# Altium schematic sheet UTHP Buffer Circuits.SchDoc: Ultimate Truck Hacking Platform
size Letter; Author: Dr. Jeremy Daily; Organization: Systems Cyber Research Group; Address2: Thomas Balzer; Address3: Carson Green; DocumentNumber: Circuit Protections; Revision: 1; SheetNumber: 5; SheetTotal: 6
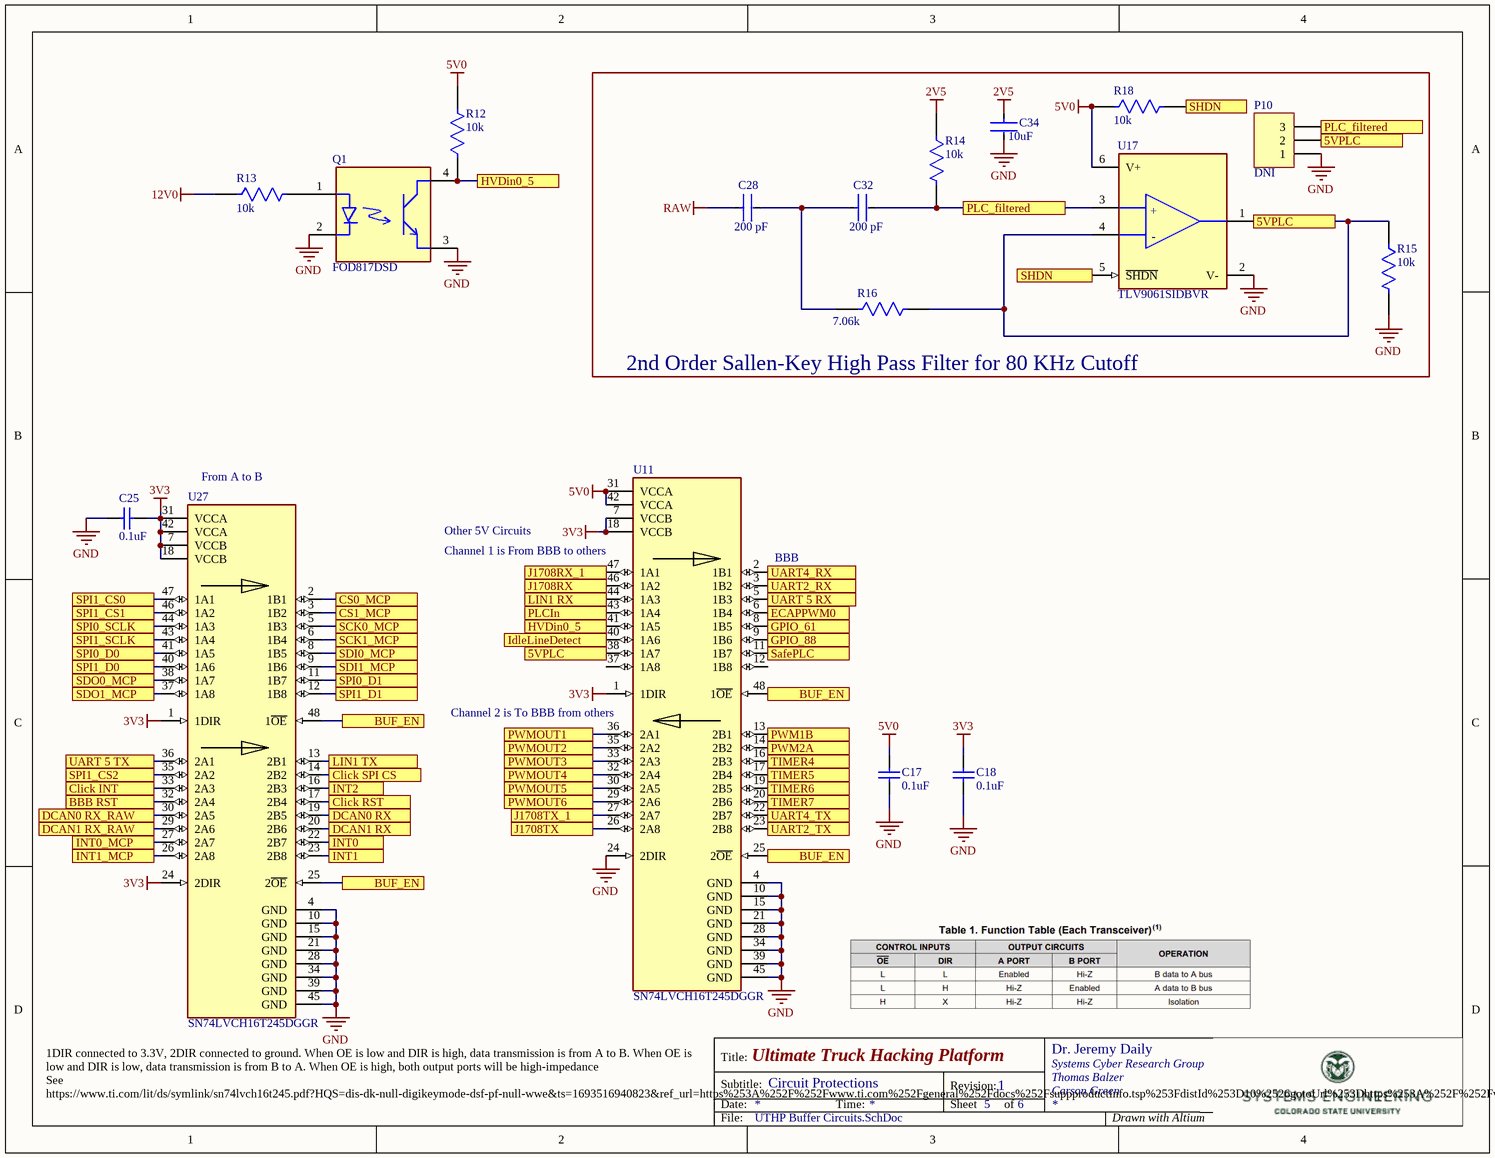
[diagram p0: UTHP Buffer Circuits.SchDoc]

## Parts
C17  0.1uF  [CAPC1608X90X35LL15T15]
C18  0.1uF  [CAPC1608X90X35LL15T15]
C25  0.1uF  [CAPC1608X90X35LL15T15]
C28  value 200 pF  [FP-C0603C-CF-MFG]  (hidden comment: C0603C201J5GACTU)
C32  value 200 pF  [FP-C0603C-CF-MFG]  (hidden comment: C0603C201J5GACTU)
C34  10uF  [FP-MK325A-MFG]
P10  DNI  [HDR1X3]
Q1  FOD817DSD  [FP-709AH-MFG]
R12  10k  [FP-KTR03-IPC_B]
R13  10k  [FP-KTR03-IPC_B]
R14  10k  [FP-KTR03-IPC_B]
R15  10k  [FP-KTR03-IPC_B]
R16  Resistance: 7.06k  [FP-RN731J-IPC_C]  (hidden comment: RN731JTTD7061F25)
R18  10k  [FP-KTR03-IPC_B]
U11  SN74LVCH16T245DGGR  [FP-DGG0048A-MFG]
U17  TLV9061SIDBVR  [FP-DBV0006A-MFG]
U27  SN74LVCH16T245DGGR  [FP-DGG0048A-MFG]

## Blocks framed on the sheet
2nd Order Sallen-Key High Pass Filter for 80 KHz Cutoff: C28 C32 C34 P10 R14-R16 R18 U17

## Ports
5VPLC, BBB RST, BUF_EN, Click INT, Click RST, Click SPI CS, CS0_MCP, CS1_MCP, DCAN0 RX, DCAN0 RX_RAW, DCAN1 RX, DCAN1 RX_RAW, ECAPPWM0, GPIO_61, GPIO_88, HVDin0_5, IdleLineDetect, INT0, INT0_MCP, INT1, INT1_MCP, INT2, J1708RX, J1708RX_1, J1708TX, J1708TX_1, LIN1 RX, LIN1 TX, PLC_filtered, PLCIn, PWM1B, PWM2A, PWMOUT1, PWMOUT2, PWMOUT3, PWMOUT4, PWMOUT5, PWMOUT6, SafePLC, SCK0_MCP, SCK1_MCP, SDI0_MCP, SDI1_MCP, SDO0_MCP, SDO1_MCP, SHDN, SPI0_D0, SPI0_D1, SPI0_SCLK, SPI1_CS0, SPI1_CS1, SPI1_CS2, SPI1_D0, SPI1_D1, SPI1_SCLK, TIMER4, TIMER5, TIMER6, TIMER7, UART2_RX, UART2_TX, UART4_RX, UART4_TX, UART 5 RX, UART 5 TX

## Nets
2V5: C34.1 R14.1
3V3: C18.1 C25.1 U11.1(1DIR) U11.7(VCCB) U11.18(VCCB) U27.1(1DIR) U27.7(VCCB) U27.18(VCCB) U27.24(2DIR) U27.31(VCCA) U27.42(VCCA)
5V0: C17.1 R12.2 R18.1 U11.31(VCCA) U11.42(VCCA) U17.6(V+)
12V0: R13.1
GND: C17.2 C18.2 C25.2 C34.2 P10.1 Q1.2(C) Q1.3(E) R15.2 U11.4(GND) U11.10(GND) U11.15(GND) U11.21(GND) U11.24(2DIR) U11.28(GND) U11.34(GND) U11.39(GND) U11.45(GND) U17.2(V-) U27.4(GND) U27.10(GND) U27.15(GND) U27.21(GND) U27.28(GND) U27.34(GND) U27.39(GND) U27.45(GND)
RAW: C28.1
5VPLC: P10.2 R15.1 R16.2 U11.38(1A7) U17.1(OUT) U17.4(-IN) ; port 5VPLC
BBB RST: U27.32(2A4) ; port BBB RST
BUF_EN: U11.25(2~{OE}) U11.48(1~{OE}) U27.25(2~{OE}) U27.48(1~{OE}) ; port BUF_EN
Click INT: U27.33(2A3) ; port Click INT
Click RST: U27.17(2B4) ; port Click RST
Click SPI CS: U27.14(2B2) ; port Click SPI CS
CS0_MCP: U27.2(1B1) ; port CS0_MCP
CS1_MCP: U27.3(1B2) ; port CS1_MCP
DCAN0 RX: U27.19(2B5) ; port DCAN0 RX
DCAN0 RX_RAW: U27.30(2A5) ; port DCAN0 RX_RAW
DCAN1 RX: U27.20(2B6) ; port DCAN1 RX
DCAN1 RX_RAW: U27.29(2A6) ; port DCAN1 RX_RAW
ECAPPWM0: U11.6(1B4) ; port ECAPPWM0
GPIO_61: U11.8(1B5) ; port GPIO_61
GPIO_88: U11.9(1B6) ; port GPIO_88
HVDin0_5: Q1.4(C) R12.1 U11.41(1A5) ; port HVDin0_5
IdleLineDetect: U11.40(1A6) ; port IdleLineDetect
INT0: U27.22(2B7) ; port INT0
INT0_MCP: U27.27(2A7) ; port INT0_MCP
INT1: U27.23(2B8) ; port INT1
INT1_MCP: U27.26(2A8) ; port INT1_MCP
INT2: U27.16(2B3) ; port INT2
J1708RX: U11.46(1A2) ; port J1708RX
J1708RX_1: U11.47(1A1) ; port J1708RX_1
J1708TX: U11.26(2A8) ; port J1708TX
J1708TX_1: U11.27(2A7) ; port J1708TX_1
LIN1 RX: U11.44(1A3) ; port LIN1 RX
LIN1 TX: U27.13(2B1) ; port LIN1 TX
PLC_filtered: C32.2 P10.3 R14.2 U17.3(+IN) ; port PLC_filtered
PLCIn: U11.43(1A4) ; port PLCIn
PWM1B: U11.13(2B1) ; port PWM1B
PWM2A: U11.14(2B2) ; port PWM2A
PWMOUT1: U11.36(2A1) ; port PWMOUT1
PWMOUT2: U11.35(2A2) ; port PWMOUT2
PWMOUT3: U11.33(2A3) ; port PWMOUT3
PWMOUT4: U11.32(2A4) ; port PWMOUT4
PWMOUT5: U11.30(2A5) ; port PWMOUT5
PWMOUT6: U11.29(2A6) ; port PWMOUT6
SafePLC: U11.11(1B7) ; port SafePLC
SCK0_MCP: U27.5(1B3) ; port SCK0_MCP
SCK1_MCP: U27.6(1B4) ; port SCK1_MCP
SDI0_MCP: U27.8(1B5) ; port SDI0_MCP
SDI1_MCP: U27.9(1B6) ; port SDI1_MCP
SDO0_MCP: U27.38(1A7) ; port SDO0_MCP
SDO1_MCP: U27.37(1A8) ; port SDO1_MCP
SHDN: R18.2 U17.5(~{SHDN}) ; port SHDN
SPI0_D0: U27.41(1A5) ; port SPI0_D0
SPI0_D1: U27.11(1B7) ; port SPI0_D1
SPI0_SCLK: U27.44(1A3) ; port SPI0_SCLK
SPI1_CS0: U27.47(1A1) ; port SPI1_CS0
SPI1_CS1: U27.46(1A2) ; port SPI1_CS1
SPI1_CS2: U27.35(2A2) ; port SPI1_CS2
SPI1_D0: U27.40(1A6) ; port SPI1_D0
SPI1_D1: U27.12(1B8) ; port SPI1_D1
SPI1_SCLK: U27.43(1A4) ; port SPI1_SCLK
TIMER4: U11.16(2B3) ; port TIMER4
TIMER5: U11.17(2B4) ; port TIMER5
TIMER6: U11.19(2B5) ; port TIMER6
TIMER7: U11.20(2B6) ; port TIMER7
UART2_RX: U11.3(1B2) ; port UART2_RX
UART2_TX: U11.23(2B8) ; port UART2_TX
UART4_RX: U11.2(1B1) ; port UART4_RX
UART4_TX: U11.22(2B7) ; port UART4_TX
UART 5 RX: U11.5(1B3) ; port UART 5 RX
UART 5 TX: U27.36(2A1) ; port UART 5 TX
NetC28_2: C28.2 C32.1 R16.1
NetQ1_1: Q1.1(A) R13.2

Not connected (* = marked no-connect by the designer): U11 12(1B8) 37(1A8)

## Notes on the sheet
- (near U27) From A to B
- (near U11) Channel 1 is From BBB to others
- Other 5V Circuits
- (near U11) BBB
- (near U11) Channel 2 is To BBB from others
- (near U27) 1DIR connected to 3.3V, 2DIR connected to ground. When OE is low and DIR is high, data transmission is from A to B. When OE is low and DIR is low, data transmission is from B to A. When OE is high, both output ports will be high-impedance
  See https://www.ti.com/lit/ds/symlink/sn74lvch16t245.pdf?HQS=dis-dk-null-digikeymode-dsf-pf-null-wwe&ts=1693516940823&ref_url=https%253A%252F%252Fwww.ti.com%252Fgeneral%252Fdocs%252Fsuppproductinfo.tsp%253FdistId%253D10%2526gotoUrl%253Dhttps%253A%252F%252Fwww.ti.com%252Flit%252Fgpn%252Fsn74lvch16t245
- Title:
- Subtitle:
- Date:
- Time:
- Revision:
- Sheet
- of
- File:
- Drawn with Altium
- (in symbol CMP-04895-000376-1) +; -

## Library data of the parts
C17 C18 C25 = CMP-2006-04387-1: 0.1 µF ±10% 50V Ceramic Capacitor X7R 0603 (1608 Metric); Manufacturer: KYOCERA AVX; Part Number: KAM15AR71H104KM; Supplier 1: Digi-Key; Supplier Part Number 1: 478-KAM15AR71H104KMTR-ND; Value: 0.1uF
C28 C32 = CMP-1035-01444-3: CAP CER 200PF 50V 5% NP0 0603; Manufacturer: KEMET; Automotive Grade: Grade 1; Temperature Characteristic: C0G; Temperature Coefficient: 30ppm/°C; Tolerance: 0.05; Material: Ceramic; Temperature Range High: +125°C; Digikey Description: CAP CER 200PF 50V 5% NP0 0603; ComponentLink2Description: Datasheet; Package: C0603C-CF; Mouser Description: Multilayer Ceramic Capacitors MLCC - SMD/SMT 50volts 200pF C0G 5%; Voltage Rating: 50 V; Capacitance: 200 pF; Temperature Range Low: -55°C; Device Class L2: Capacitors; Temperature: -55°C to +125°C; Device Class L1: Passive Components; Device Class L3: Ceramic Capacitors; ComponentLink2URL: https://api.kemet.com/component-edge/download/datasheet/C0603C100J5GACAUTO.pdf; Height: 0.87mm; Automotive: Yes; Octopart: https://octopart.com/c0603c201j5gactu-kemet-9143917; Category: Cap; Manufacturer Part Number: C0603C201J5GACTU; Lead Free: Yes; RoHS: TRUE
C34 = CMP-14477-002214-1: CAP CER 10UF 50V X7R 1210 UMK325AB7106KM-T; Manufacturer: Taiyo Yuden; Part Number: UMK325AB7106KM-T; Supplier 1: Digi-Key; Supplier Part Number 1: 587-3167-1-ND
P10 = CMP-096-000090-1: Header, 3-Pin; Signal Integrity: Connector; LatestRevisionDate: 17-Jul-2002; Publisher: Altium Limited; Design Item ID: Header 3; Source: Miscellaneous Connectors.SchLib; LatestRevisionNote: Re-released for DXP Platform.; Pin Count: 3; Component Type: Standard
Q1 = CMP-2000-06281-2: OPTOISOLATOR 5KV TRANSISTOR 4SMD; Manufacturer: ON Semiconductor; Collector Emitter Voltage: 70V; Forward Voltage: 1.2V; Isolation Voltage: 5000Vrms; Reverse Voltage: 6V; Forward Current: 50mA; Max Junction Temp: +125°C; Power Dissipation: 70mW; Standoff Height: 0.35mm; Min Current Transfer Ratio: 300%; Max Current Transfer Ratio: 600%; Lead Free: Yes; ComponentLink2URL: https://www.onsemi.cn/PowerSolutions/document/FOD814-D.PDF; RoHS: TRUE; Temperature Range Low: -55°C; Height: 3.85mm; Automotive: No; Octopart: https://octopart.com/fod817dsd-on+semiconductor-84327554; Device Class L2: Optocouplers; Emiiter Collector Voltage: 6V; Category: Trans; Device Class L1: Optoelectronics; ComponentLink2Description: Datasheet; Package: 709AH; Temperature Range High: +110°C; Temperature: -55°C to +110°C; Digikey Description: OPTOISOLATOR 5KV TRANSISTOR 4SMD; Device Class L3: unset; Mouser Description: OPTOISOLATOR 5KV TRANSISTOR 4SMD; Manufacturer Part Number: FOD817DSD; Footprint Url: https://www.onsemi.com/pub/Collateral/709AH.PDF
R12-R15 R18 = CMP-08839-030382-1: 10 kOhms ±1% 0.1W, 1/10W Chip Resistor 0603 (1608 Metric) Automotive AEC-Q200, High Voltage Thick Film; Manufacturer: Rohm Semiconductor; Part Number: KTR03EZPF1002; Supplier 1: Digi-Key; Supplier Part Number 1: RHM10.0KAYCT-ND; Value: 10k
R16 = CMP-04015-073316-1: 7.06kΩ ±1% 0.063W, 1/16W Chip Resistor 0603 (1608 Metric) Moisture Resistant Thin Film; Temperature Coefficient: 25ppm/°C; Power Rating: 63mW; Voltage Rating: 50V; Min Operating Temperature: -55°C; Case Code (Metric): 1608; Resistor Type: Thin Film; Width: 0.8mm; Weight: 7.1E-05oz; Packaging: Tape and Reel; Case/Package: 0603; Length: 1.6mm; Termination: SMD/SMT; Case Code (Imperial): 0603; Series: RN73; Max Operating Temperature: 125°C; Height: 0.45mm; Tolerance: 1%
U11 U27 = CMP-04899-000008-1: Translation Transceiver 2 Element 8 Bit per Element 3-State Output 48-TSSOP; Manufacturer: Texas Instruments; Value: Bidirectional Translator; Part Number: SN74LVCH16T245DGGR; Supplier 1: Digi-Key; Supplier Part Number 1: 296-19568-1-ND
U17 = CMP-04895-000376-1: IC CMOS 1 CIRCUIT SOT23-6; RoHS Compliant: Yes